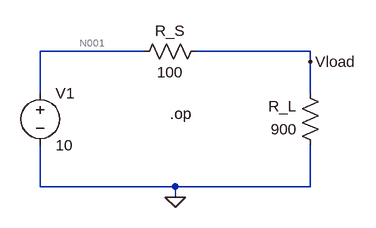
[diagram p0: schematic 0.asc]
0.asc, the LTspice schematic file:
Version 4
SHEET 1 880 680
WIRE 112 -112 -48 -112
WIRE 368 -112 192 -112
WIRE 368 -96 368 -112
WIRE -48 -48 -48 -112
WIRE 368 -48 368 -96
WIRE -48 96 -48 32
WIRE 160 96 -48 96
WIRE 368 96 368 32
WIRE 368 96 160 96
WIRE 160 112 160 96
FLAG 160 112 0
FLAG 368 -96 Vload
SYMBOL res 384 48 R180
WINDOW 0 36 76 Left 2
WINDOW 3 36 40 Left 2
SYMATTR InstName R_L
SYMATTR Value 900
SYMBOL res 208 -128 R90
WINDOW 0 0 56 VBottom 2
WINDOW 3 32 56 VTop 2
SYMATTR InstName R_S
SYMATTR Value 100
SYMBOL voltage -48 -64 R0
WINDOW 123 0 0 Left 0
WINDOW 39 0 0 Left 0
SYMATTR InstName V1
SYMATTR Value 10
TEXT 152 -16 Left 2 !.op

The netlist it stands for:
* 0.asc
R_L 0 Vload 900
R_S Vload N001 100
V1 N001 0 10
.op
.backanno
.end

* Results of the author's LTspice run, read from the files saved beside the schematic
* Operating Point:
*   V(vload) = 9 V
*   V(n001) = 10 V
*   I(R_l) = -10 mA
*   I(R_s) = -10 mA
*   I(V1) = -10 mA